# Altium project DAC8541 Mono Board PCB.PrjPcb
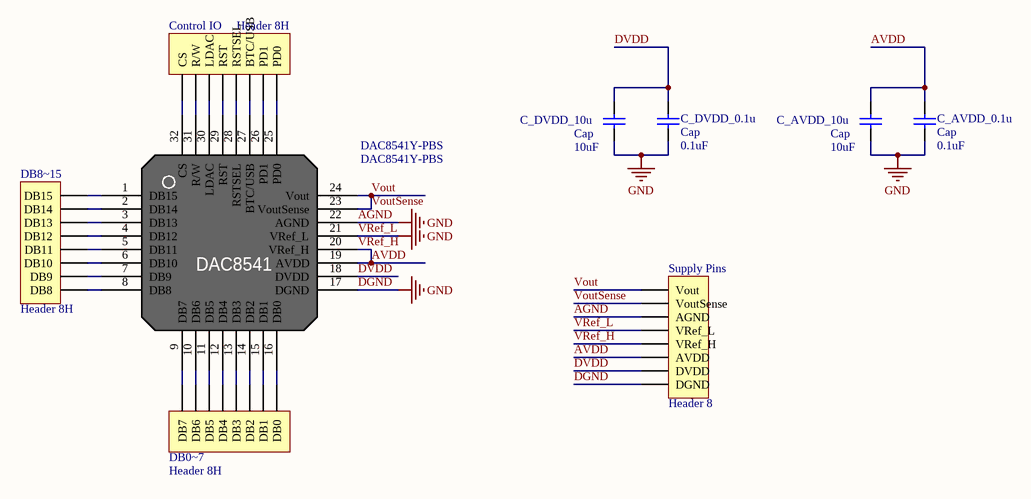
[diagram p0: DAC8541 Mono Board Schematic.SchDoc]
1 sheet, 9 parts. Net scope: global (net labels, ports and power ports of the same name join across sheets).
Board files: DAC8541 Mono Board PCB.PcbDoc, DAC8541 Mono Board PCB Panel.PcbDoc

## Sheet DAC8541 Mono Board Schematic.SchDoc
size A4

### Parts
C_AVDD_0.1u  Cap  value 0.1uF  [6-0805_N]
C_AVDD_10u  Cap  value 10uF  [6-0805_N]
C_DVDD_0.1u  Cap  value 0.1uF  [6-0805_N]
C_DVDD_10u  Cap  value 10uF  [6-0805_N]
Control_IO  Header 8H  [Header8pin]
DAC8541Y-PBS  DAC8541Y-PBS  [TSQFP50P700X700X120-32N]
DB0~7  Header 8H  [Header8pin]
DB8~15  Header 8H  [Header8pin]
Supply_Pins  Header 8  [Header8pin]

### Nets
AGND: C_AVDD_0.1u.1 C_AVDD_10u.1 C_DVDD_0.1u.1 C_DVDD_10u.1 DAC8541Y-PBS.17(DGND) DAC8541Y-PBS.21(VRef_L) DAC8541Y-PBS.22(AGND) Supply_Pins.3(AGND) Supply_Pins.4(VRef_L) Supply_Pins.8(DGND)  [also labelled DGND, GND, VRef_L]
AVDD: C_AVDD_0.1u.2 C_AVDD_10u.2 DAC8541Y-PBS.19(AVDD) DAC8541Y-PBS.20(VRef_H) Supply_Pins.5(VRef_H) Supply_Pins.6(AVDD)  [also labelled VRef_H]
DVDD: C_DVDD_0.1u.2 C_DVDD_10u.2 DAC8541Y-PBS.18(DVDD) Supply_Pins.7(DVDD)
Vout: DAC8541Y-PBS.23(VoutSense) DAC8541Y-PBS.24(Vout) Supply_Pins.1(Vout) Supply_Pins.2(VoutSense)  [also labelled VoutSense]
NetControl_IO_1: Control_IO.1(CS) DAC8541Y-PBS.32(CS)
NetControl_IO_2: Control_IO.2(R/W) DAC8541Y-PBS.31(R/W)
NetControl_IO_3: Control_IO.3(LDAC) DAC8541Y-PBS.30(LDAC)
NetControl_IO_4: Control_IO.4(RST) DAC8541Y-PBS.29(RST)
NetControl_IO_5: Control_IO.5(RSTSEL) DAC8541Y-PBS.28(RSTSEL)
NetControl_IO_6: Control_IO.6(BTC/USB) DAC8541Y-PBS.27(BTC/USB)
NetControl_IO_7: Control_IO.7(PD1) DAC8541Y-PBS.26(PD1)
NetControl_IO_8: Control_IO.8(PD0) DAC8541Y-PBS.25(PD0)
NetDAC8541Y-PBS_1: DAC8541Y-PBS.1(DB15) DB8~15.8(DB15)
NetDAC8541Y-PBS_2: DAC8541Y-PBS.2(DB14) DB8~15.7(DB14)
NetDAC8541Y-PBS_3: DAC8541Y-PBS.3(DB13) DB8~15.6(DB13)
NetDAC8541Y-PBS_4: DAC8541Y-PBS.4(DB12) DB8~15.5(DB12)
NetDAC8541Y-PBS_5: DAC8541Y-PBS.5(DB11) DB8~15.4(DB11)
NetDAC8541Y-PBS_6: DAC8541Y-PBS.6(DB10) DB8~15.3(DB10)
NetDAC8541Y-PBS_7: DAC8541Y-PBS.7(DB9) DB8~15.2(DB9)
NetDAC8541Y-PBS_8: DAC8541Y-PBS.8(DB8) DB8~15.1(DB8)
NetDAC8541Y-PBS_9: DAC8541Y-PBS.9(DB7) DB0~7.8(DB7)
NetDAC8541Y-PBS_10: DAC8541Y-PBS.10(DB6) DB0~7.7(DB6)
NetDAC8541Y-PBS_11: DAC8541Y-PBS.11(DB5) DB0~7.6(DB5)
NetDAC8541Y-PBS_12: DAC8541Y-PBS.12(DB4) DB0~7.5(DB4)
NetDAC8541Y-PBS_13: DAC8541Y-PBS.13(DB3) DB0~7.4(DB3)
NetDAC8541Y-PBS_14: DAC8541Y-PBS.14(DB2) DB0~7.3(DB2)
NetDAC8541Y-PBS_15: DAC8541Y-PBS.15(DB1) DB0~7.2(DB1)
NetDAC8541Y-PBS_16: DAC8541Y-PBS.16(DB0) DB0~7.1(DB0)

### Notes on the sheet
- (in symbol DAC8541Y-PBS) DAC8541

### Library data of the parts
C_AVDD_0.1u C_AVDD_10u C_DVDD_0.1u C_DVDD_10u = Cap: Capacitor; Published: 8-Jun-2000; LatestRevisionDate: 17-Jul-2002; LatestRevisionNote: Re-released for DXP Platform.; PackageReference: RAD-0.3; Publisher: Altium Limited; PackageDescription: Radial Cap, Thru-Hole; 2 Leads; 0.3 in Pin Spacing
Control_IO DB0~7 DB8~15 = Header 8H: Header, 8-Pin, Right Angle; LatestRevisionDate: 17-Jul-2002; LatestRevisionNote: Re-released for DXP Platform.; Publisher: Altium Limited
Supply_Pins = Header 8: Header, 8-Pin; LatestRevisionDate: 17-Jul-2002; LatestRevisionNote: Re-released for DXP Platform.; Publisher: Altium Limited